# Altium schematic sheet ESP32Oled.SchDoc
size A; SheetNumber: 1; SheetTotal: 1
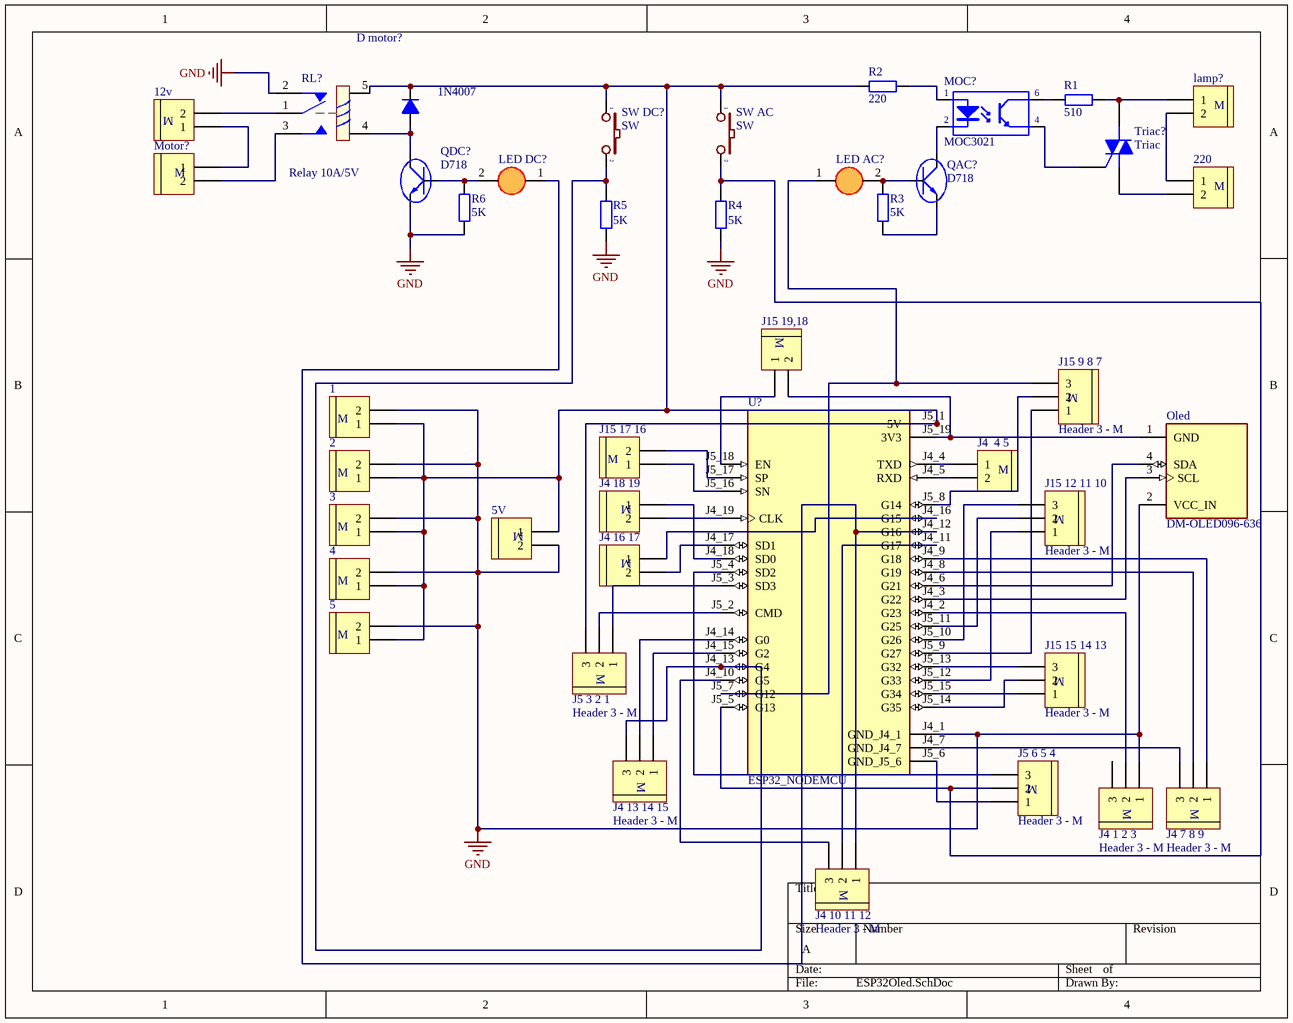
[diagram p0: ESP32Oled.SchDoc]

## Parts
1  (no value)  [Medium - Header 2]
2  (no value)  [Medium - Header 2]
3  (no value)  [Medium - Header 2]
4  (no value)  [Medium - Header 2]
5  (no value)  [Medium - Header 2]
5V  (no value)  [Medium - Header 2]
12v  (no value)  [Medium - Header 2]
220  (no value)  [Medium - Header 2]
D_motor?  1N4007  [D1A]
J4_1_2_3  Header 3 - M  [Medium - Header 3]
J4_4_5  (no value)  [Medium - Header 2]
J4_7_8_9  Header 3 - M  [Medium - Header 3]
J4_10_11_12  Header 3 - M  [Medium - Header 3]
J4_13_14_15  Header 3 - M  [Medium - Header 3]
J4_16_17  (no value)  [Medium - Header 2]
J4_18_19  (no value)  [Medium - Header 2]
J5_3_2_1  Header 3 - M  [Medium - Header 3]
J5_6_5_4  Header 3 - M  [Medium - Header 3]
J15_9_8_7  Header 3 - M  [Medium - Header 3]
J15_12_11_10  Header 3 - M  [Medium - Header 3]
J15_15_14_13  Header 3 - M  [Medium - Header 3]
J15_17_16  (no value)  [Medium - Header 2]
J15_19,18  (no value)  [Medium - Header 2]
lamp?  (no value)  [Medium - Header 2]
LED_AC?  (no value)  [LED3mm]
LED_DC?  (no value)  [LED3mm]
MOC?  MOC3021  [DIP6]
Motor?  (no value)  [Medium - Header 2]
Oled  DM-OLED096-636  [MODULE_DM-OLED096-636]
QAC?  D718  [QTO-247]
QDC?  D718  [QTO-247]
R1  510  [R1/4W]
R2  220  [R1/4W]
R3  5K  [R1/4W]
R4  5K  [R1/4W]
R5  5K  [R1/4W]
R6  5K  [R1/4W]
RL?  Relay 10A/5V  [RELAY 5]
SW_AC  SW  [SW2]
SW_DC?  SW  [SW2]
Triac?  Triac  [369-03]
U?  ESP32_NODEMCU  [MODULE_ESP32_NODEMCU]

## Nets
GND: 1.2 2.2 3.2 4.2 5.2 5V.2 J4_1_2_3.1 Oled.2(VCC_IN) QDC?.3(E) R4.2 R5.2 R6.2 RL?.2 U?.J4_1(GND_J4_1)
Net1_1: 1.1 2.1 3.1 4.1 5.1 5V.1 D_motor?.2(K) J5_3_2_1.3 R2.1 RL?.5 SW_AC.1 SW_DC?.1 U?.J5_1(5V)
Net12v_1: 12v.1 Motor?.1
Net12v_2: 12v.2 RL?.1
Net220_1: 220.1 lamp?.2
Net220_2: 220.2 Triac?.1(M1)
NetD_motor?_1: D_motor?.1(A) QDC?.2(C) RL?.4
NetJ4_1_2_3_2: J4_1_2_3.2 U?.J4_2(G23)
NetJ4_4_5_1: J4_4_5.1 U?.J4_4(TXD)
NetJ4_4_5_2: J4_4_5.2 U?.J4_5(RXD)
NetJ4_7_8_9_1: J4_7_8_9.1 U?.J4_9(G18)
NetJ4_7_8_9_2: J4_7_8_9.2 U?.J4_8(G19)
NetJ4_7_8_9_3: J4_7_8_9.3 U?.J4_7(GND_J4_7)
NetJ4_10_11_12_1: J4_10_11_12.1 LED_DC?.1(A) U?.J4_12(G16)
NetJ4_10_11_12_2: J4_10_11_12.2 U?.J4_11(G17)
NetJ4_10_11_12_3: J4_10_11_12.3 U?.J4_10(G5)
NetJ4_13_14_15_1: J4_13_14_15.1 U?.J4_15(G2)
NetJ4_13_14_15_2: J4_13_14_15.2 U?.J4_14(G0)
NetJ4_13_14_15_3: J4_13_14_15.3 R5.1 SW_DC?.2 U?.J4_13(G4)
NetJ4_16_17_1: J4_16_17.1 U?.J4_16(G15)
NetJ4_16_17_2: J4_16_17.2 U?.J4_17(SD1)
NetJ4_18_19_1: J4_18_19.1 U?.J4_18(SD0)
NetJ4_18_19_2: J4_18_19.2 U?.J4_19(CLK)
NetJ5_3_2_1_1: J5_3_2_1.1 U?.J5_3(SD3)
NetJ5_3_2_1_2: J5_3_2_1.2 U?.J5_2(CMD)
NetJ5_6_5_4_1: J5_6_5_4.1 U?.J5_6(GND_J5_6)
NetJ5_6_5_4_2: J5_6_5_4.2 R4.1 SW_AC.2 U?.J5_5(G13)
NetJ5_6_5_4_3: J5_6_5_4.3 U?.J5_4(SD2)
NetJ15_9_8_7_1: J15_9_8_7.1 U?.J5_9(G27)
NetJ15_9_8_7_2: J15_9_8_7.2 U?.J5_8(G14)
NetJ15_9_8_7_3: J15_9_8_7.3 LED_AC?.1(A) U?.J5_7(G12)
NetJ15_12_11_10_1: J15_12_11_10.1 U?.J5_12(G33)
NetJ15_12_11_10_2: J15_12_11_10.2 U?.J5_11(G25)
NetJ15_12_11_10_3: J15_12_11_10.3 U?.J5_10(G26)
NetJ15_15_14_13_1: J15_15_14_13.1 U?.J5_15(G34)
NetJ15_15_14_13_2: J15_15_14_13.2 U?.J5_14(G35)
NetJ15_15_14_13_3: J15_15_14_13.3 U?.J5_13(G32)
NetJ15_17_16_1: J15_17_16.1 U?.J5_16(SN)
NetJ15_17_16_2: J15_17_16.2 U?.J5_17(SP)
NetJ15_19,18_1: J15_19,18.1 U?.J5_18(EN)
NetJ15_19,18_2: J15_19,18.2 Oled.1(GND) U?.J5_19(3V3)
Netlamp?_1: lamp?.1 R1.2 Triac?.2(M2)
NetLED_AC?_2: LED_AC?.2(K) QAC?.1(B) R3.2
NetLED_DC?_2: LED_DC?.2(K) QDC?.1(B) R6.1
NetMOC?_1: MOC?.1(A) R2.2
NetMOC?_2: MOC?.2(K) QAC?.2(C)
NetMOC?_4: MOC?.4(E) Triac?.3(G)
NetMOC?_6: MOC?.6(C) R1.1
NetMotor?_2: Motor?.2 RL?.3
NetOled_3: Oled.3(SCL) U?.J4_3(G22)
NetOled_4: Oled.4(SDA) U?.J4_6(G21)
NetQAC?_3: QAC?.3(E) R3.1

Not connected (* = marked no-connect by the designer): J4_1_2_3 3

## Notes on the sheet
- (in symbol Header 2 - M) M
- (in symbol Header 3 - M) M

## Library data of the parts
1-5 5V 12v 220 J4_4_5 J4_16_17 J4_18_19 J15_17_16 J15_19,18 lamp? Motor? = Header 2 - M: Header, 2-Pin, Medium; LatestRevisionDate: 17-Jul-2002; LatestRevisionNote: Re-released for DXP Platform.; Publisher: Altium Limited
D_motor? = D1A: Diode 1A; Value: 1N4007
J4_1_2_3 J4_7_8_9 J4_10_11_12 J4_13_14_15 J5_3_2_1 J5_6_5_4 J15_9_8_7 J15_12_11_10 J15_15_14_13 = Header 3 - M: Header, 3-Pin, Medium; LatestRevisionDate: 17-Jul-2002; LatestRevisionNote: Re-released for DXP Platform.; Publisher: Altium Limited
LED_AC? LED_DC? = LED 3mm
MOC? = MOC3021: Single Opto; Value: MOC3021
Oled = DM-OLED096-636: 0.96â€ 128 X 64 MONOCHROME GRAPHIC OLED DISPLAY MODULE - I2C; SnapEDA_Link: https://www.snapeda.com/parts/DM-OLED096-636/Display+Module/view-part/?ref=snap; Package: Package; Value: *; MF: Display Module; MP: DM-OLED096-636; Check_prices: https://www.snapeda.com/parts/DM-OLED096-636/Display+Module/view-part/?ref=eda
QAC? QDC? = D718: Transistor Power Supply; Value: D718
R1-R6 = R1/4W: Resistor 1/4W; Value: R1/4W - 1K
RL? = Relay 5: Relay SPDT,10A - 12VDC 5 Pin; Value: Relay SPDT, 10A, 12V
SW_AC SW_DC? = SW2: Switch button 2 pin; Value: SW chip 2 pin
Triac? = Triac: Silicon Bidirectional Triode Thyristor; Note: Pin 2 is electrically connected to Pin 4 (TAB); Published: 29-Sep-2000; LatestRevisionDate: 17-Jul-2002; LatestRevisionNote: Re-released for DXP Platform.; DatasheetVersion: 1999; PackageReference: 369-03; Publisher: Altium Limited; PackageDescription: TO, Thru-Hole, Vertical, Heatsink Mounted; 3 In-Line Leads; Pitch 2.28 mm; ComponentLink1Description: Manufacturer Link; ComponentLink1URL: http://www.motorola.com/
U? = ESP32_NODEMCU: NodeMCU is an open source loT platform. ESP32 is a series of low cost, low powersystem-on-chip (SoC) microcontrollers with integrated Wi-Fi & dual-mode Bluetooth.; MF: Espressif Systems; MP: ESP32 NODEMCU; SnapEDA_Link: https://www.snapeda.com/parts/ESP32%20NODEMCU/Espressif+Systems/view-part/?ref=snap; Package: Package; Value: *; Check_prices: https://www.snapeda.com/parts/ESP32%20NODEMCU/Espressif+Systems/view-part/?ref=eda